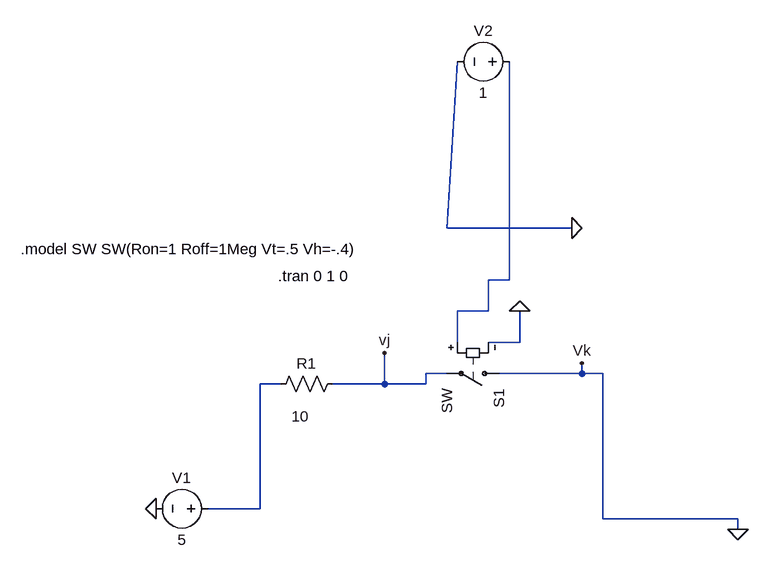
[diagram p0: schematic Draft1.asc]
Draft1.asc, the LTspice schematic file:
Version 4
SHEET 1 880 680
WIRE 16 -416 32 -672
WIRE 208 -416 16 -416
WIRE 112 -336 112 -672
WIRE 112 -336 80 -336
WIRE 80 -288 80 -336
WIRE 80 -288 32 -288
WIRE 32 -240 32 -288
WIRE 128 -240 128 -288
WIRE 128 -240 80 -240
WIRE 16 -192 -16 -192
WIRE 224 -192 224 -208
WIRE 224 -192 96 -192
WIRE 256 -192 224 -192
WIRE -240 -176 -272 -176
WIRE -80 -176 -80 -224
WIRE -80 -176 -160 -176
WIRE -16 -176 -16 -192
WIRE -16 -176 -80 -176
WIRE -272 16 -272 -176
WIRE -272 16 -352 16
WIRE 256 32 256 -192
WIRE 464 32 256 32
WIRE 464 48 464 32
FLAG -432 16 0
FLAG 464 48 0
FLAG -80 -224 vj
FLAG 128 -288 0
FLAG 224 -208 Vk
FLAG 208 -416 0
SYMBOL voltage -336 16 R90
WINDOW 0 -32 56 VBottom 2
WINDOW 3 32 56 VTop 2
SYMATTR InstName V1
SYMATTR Value 5
SYMBOL res -144 -192 R90
WINDOW 0 0 56 VBottom 2
WINDOW 3 50 66 VTop 2
SYMATTR InstName R1
SYMATTR Value 10
SYMBOL sw 112 -192 R90
SYMATTR InstName S1
SYMBOL voltage 128 -672 R90
WINDOW 0 -32 56 VBottom 2
WINDOW 3 32 56 VTop 2
WINDOW 123 0 0 Left 0
WINDOW 39 0 0 Left 0
SYMATTR InstName V2
SYMATTR Value 1
TEXT -244 -342 Left 2 !.tran 0 1 0
TEXT -640 -384 Left 2 !.model SW SW(Ron=1 Roff=1Meg Vt=.5 Vh=-.4)

The netlist it stands for:
* Draft1.asc
V1 N002 0 5
R1 vj N002 10
S1 0 vj N001 0 SW
V2 N001 0 1
.tran 0 1 0
.model SW SW(Ron=1 Roff=1Meg Vt=.5 Vh=-.4)
.backanno
.end